# Altium schematic sheet sensors.SchDoc
size A4
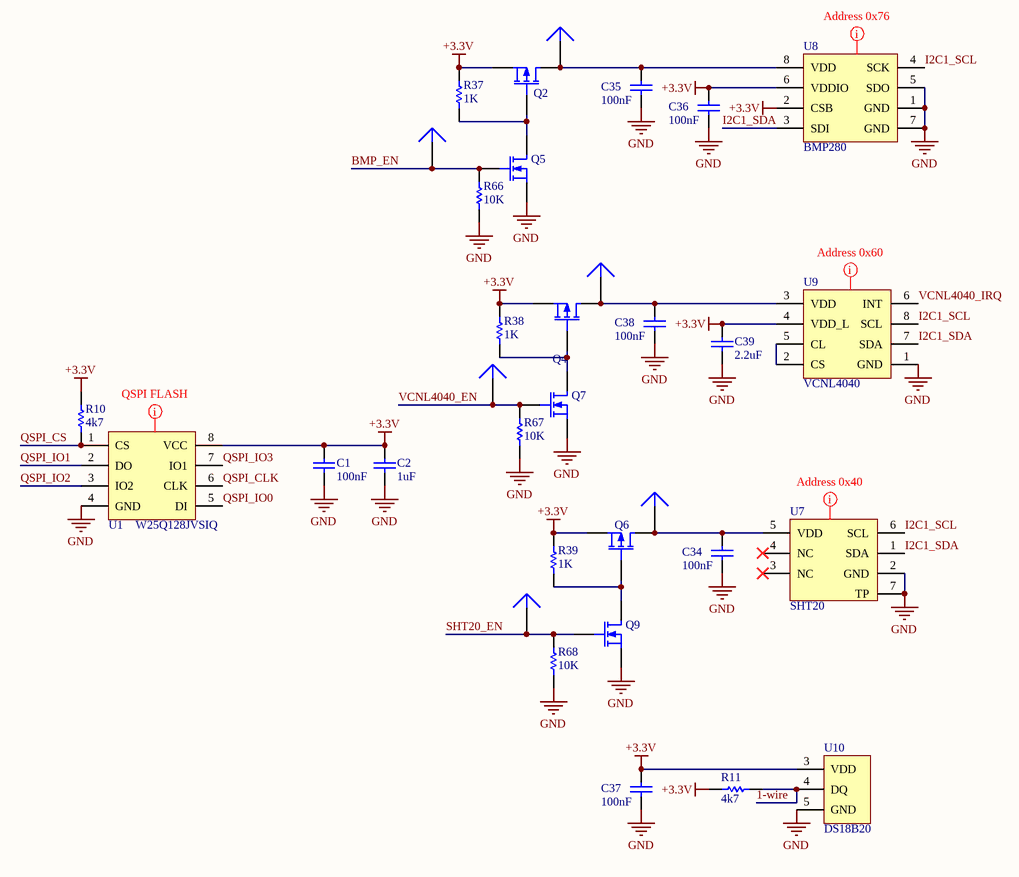
[diagram p0: sensors.SchDoc]

## Parts
C1  value 100nF  [C0402]  (hidden comment: Cap 100nF)
C2  value 1uF  [C0402]  (hidden comment: Cap 1uF)
C34  value 100nF  [C0402]  (hidden comment: Cap 100nF)
C35  value 100nF  [C0402]  (hidden comment: Cap 100nF)
C36  value 100nF  [C0402]  (hidden comment: Cap 100nF)
C37  value 100nF  [C0402]  (hidden comment: Cap 100nF)
C38  value 100nF  [C0402]  (hidden comment: Cap 100nF)
C39  value 2.2uF  [C0402]  (hidden comment: Cap 2.2uF)
P20  Plug  [pin smd]  (value not drawn)  (no BOM)
P21  Plug  [pin smd]  (value not drawn)  (no BOM)
P22  Plug  [pin smd]  (value not drawn)  (no BOM)
P26  Plug  [pin smd]  (value not drawn)  (no BOM)
P27  Plug  [pin smd]  (value not drawn)  (no BOM)
P28  Plug  [pin smd]  (value not drawn)  (no BOM)
Q2  AO3401A  [SOT23]  (value not drawn)
Q4  AO3401A  [SOT23]  (value not drawn)
Q5  AO3400A  [SOT23]  (value not drawn)
Q6  AO3401A  [SOT23]  (value not drawn)
Q7  AO3400A  [SOT23]  (value not drawn)
Q9  AO3400A  [SOT23]  (value not drawn)
R10  value 4k7  [R0402]  (hidden comment: Res_4k7)
R11  value 4k7  [R0402]  (hidden comment: Res_4k7)
R37  value 1K  [R0402]  (hidden comment: Res_1K)
R38  value 1K  [R0402]  (hidden comment: Res_1K)
R39  value 1K  [R0402]  (hidden comment: Res_1K)
R66  value 10K  [R0402]  (hidden comment: Res_10K)
R67  value 10K  [R0402]  (hidden comment: Res_10K)
R68  value 10K  [R0402]  (hidden comment: Res_10K)
U1  W25Q128JVSIQ  [SOIC8_208-mil]
U7  SHT20  [DFN6]
U8  BMP280  [LGA8]
U9  VCNL4040  [VCNL4040M3OE]
U10  DS18B20  [SO8]

## Nets
+3.3V: C1.2 C2.2 C36.2 C37.2 C39.2 Q2.2(S) Q4.2(S) Q6.2(S) R10.2 R11.1 R37.2 R38.2 R39.2 U1.8(VCC) U8.2(CSB) U8.6(VDDIO) U9.4(VDD_L) U10.3(VDD)
GND: C1.1 C2.1 C34.1 C35.1 C36.1 C37.1 C38.1 C39.1 Q5.2(S) Q7.2(S) Q9.2(S) R66.1 R67.1 R68.1 U1.4(GND) U7.2(GND) U7.7(TP) U8.1(GND) U8.5(SDO) U8.7(GND) U9.1(GND) U10.5(GND)
1-wire: R11.2 U10.4(DQ)
BMP_EN: P26.1 Q5.1(G) R66.2
I2C1_SCL: U7.6(SCL) U8.4(SCK) U9.8(SCL)
I2C1_SDA: U7.1(SDA) U8.3(SDI) U9.7(SDA)
QSPI_CLK: U1.6(CLK)
QSPI_CS: R10.1 U1.1(CS)
QSPI_IO0: U1.5(DI)
QSPI_IO1: U1.2(DO)
QSPI_IO2: U1.3(IO2)
QSPI_IO3: U1.7(IO1)
SHT20_EN: P28.1 Q9.1(G) R68.2
VCNL4040_EN: P27.1 Q7.1(G) R67.2
VCNL4040_IRQ: U9.6(INT)
NetC34_2: C34.2 P22.1 Q6.3(D) U7.5(VDD)
NetC35_2: C35.2 P20.1 Q2.3(D) U8.8(VDD)
NetC38_2: C38.2 P21.1 Q4.3(D) U9.3(VDD)
NetQ2_1: Q2.1(G) Q5.3(D) R37.1
NetQ4_1: Q4.1(G) Q7.3(D) R38.1
NetQ6_1: Q6.1(G) Q9.3(D) R39.1
NetU9_2: U9.2(CS) U9.5(CL)

Not connected (* = marked no-connect by the designer): U7 3(NC)* 4(NC)*

## Layout directives
mark named Address 0x76: (no net found under the mark)
mark named Address 0x60: (no net found under the mark)
mark named Address 0x40: (no net found under the mark)
mark named QSPI FLASH: (no net found under the mark)

## Library data of the parts
C1 C34-C38 = Cap 100nF: Capacitor
C2 = Cap 1uF: Capacitor
C39 = Cap 2.2uF: Capacitor
Q2 Q4 Q6 = MOSFET-P: P-Channel MOSFET AO3401A; Published: 8-Jun-2000; LatestRevisionDate: 17-Jul-2002; LatestRevisionNote: Re-released for DXP Platform.; PackageVersion: 1995/1996; PackageReference: E3; Publisher: Altium Limited; PackageDescription: TO, Flat Index; 3 In-Line, Axial Leads; Body Dia. 4.6mm; Lead Dia. 0.5 mm (max); ComponentLink1Description: datasheet; ComponentLink1URL: https://datasheet.lcsc.com/szlcsc/Alpha-Omega-Semicon-AOS-AO3401A_C15127.pdf
Q5 Q7 Q9 = MOSFET-N: N-MOSFET AO3400A; Published: 8-Jun-2000; LatestRevisionDate: 17-Jul-2002; LatestRevisionNote: Re-released for DXP Platform.; PackageVersion: 1995/1996; PackageReference: E3; Publisher: Altium Limited; PackageDescription: TO, Flat Index; 3 In-Line, Axial Leads; Body Dia. 4.6mm; Lead Dia. 0.5 mm (max); ComponentLink1Description: datasheet; ComponentLink1URL: https://datasheet.lcsc.com/szlcsc/1908271131_Youtai-Semiconductor-Co-Ltd-AO3400A_C347475.pdf
R10 R11 = Res_4k7: Resistor
R37-R39 = Res_1K: Resistor
R66-R68 = Res_10K: Resistor
U1 = flash_memory: SPI Flash  memory 128MB; ComponentLink1Description: tme; ComponentLink1URL: https://datasheet.lcsc.com/szlcsc/Winbond-Elec-W25Q128JVSIQTR_C97521.pdf
U7 = SHT20: Humidity and Temperature SensorIC; ComponentLink1Description: Datasheet; ComponentLink1URL: https://datasheet.lcsc.com/szlcsc/Sensirion-SHT20_C53865.pdf
U8 = BMP280: Digital Pressure Sensor; ComponentLink1Description: Datasheet; ComponentLink1URL: https://datasheet.lcsc.com/szlcsc/Bosch-Sensortec-BMP280_C83291.pdf
U9 = VCNL4040: Fully Integrated Proximity and Ambient Light Sensor withInfrared Emitter, I2C Interface, and Interrupt Function; ComponentLink1Description: Datasheet; ComponentLink1URL: https://datasheet.lcsc.com/szlcsc/Vishay-Intertech-VCNL4040M3OE_C142526.pdf
P20-P22 P26-P28 = Plug: LatestRevisionDate: 17-Jul-2002; LatestRevisionNote: Re-released for DXP Platform.; Publisher: Altium Limited
U10 = DS18B20: LatestRevisionDate: 17-Jul-2002; LatestRevisionNote: Re-released for DXP Platform.; Publisher: Altium Limited